# EAGLE design Schematic (EAGLE 9.6.2)
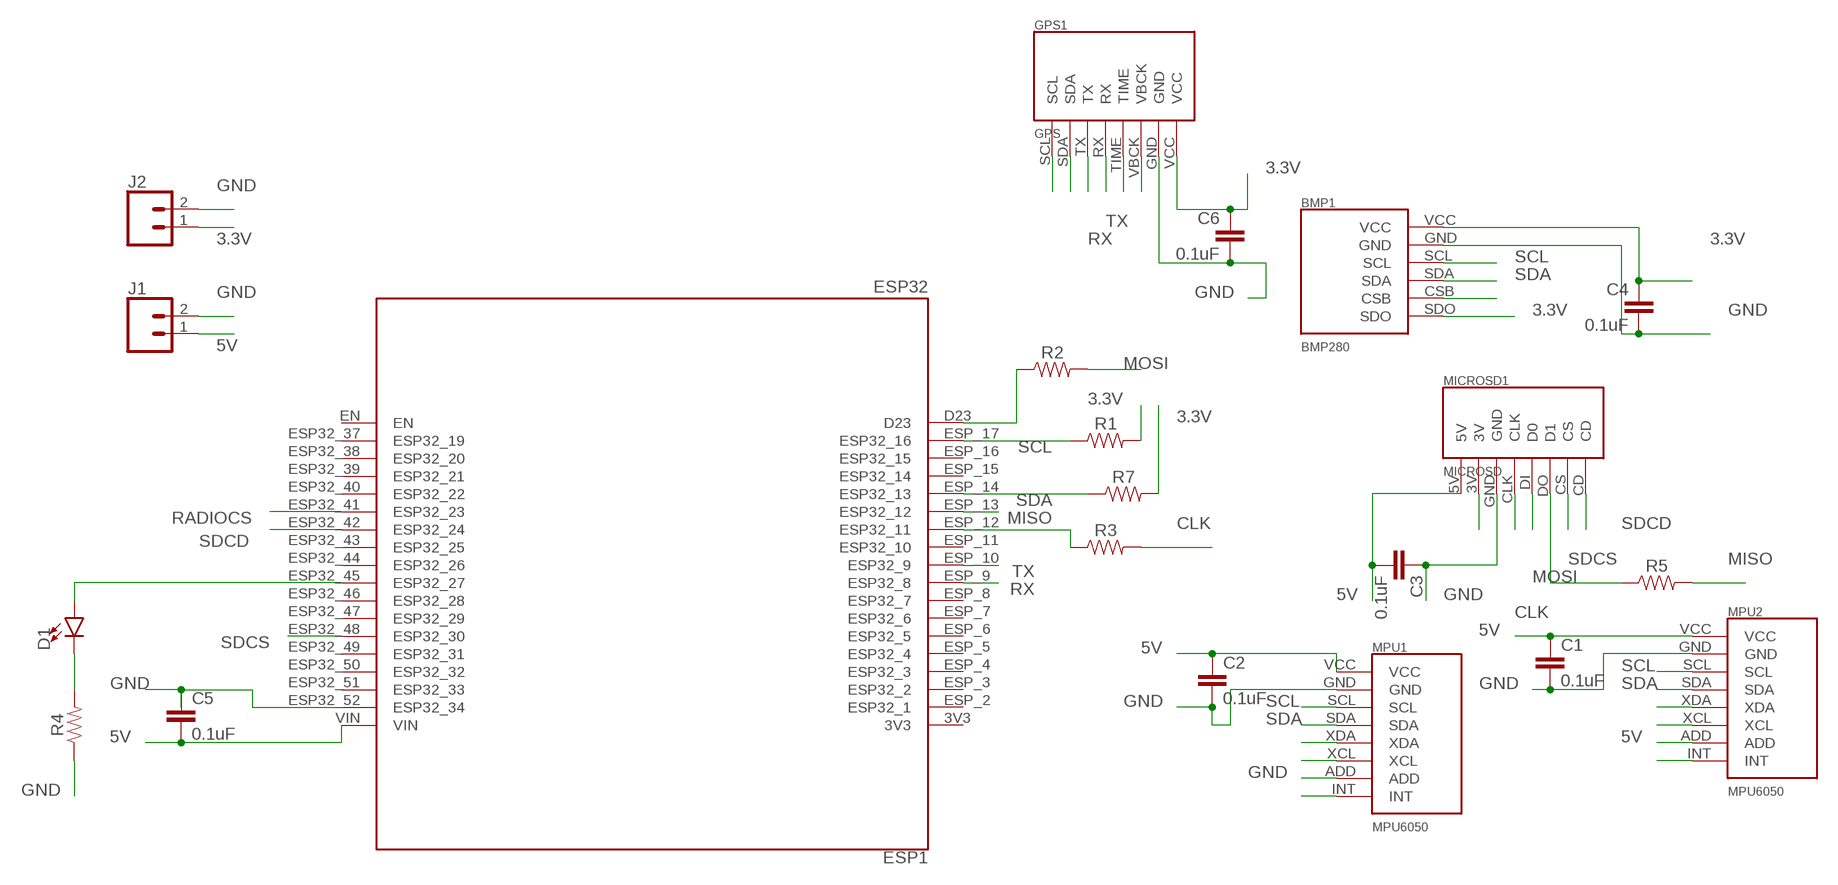
[diagram p0: schematic, sheet 1]

## Parts
BMP1  BMP280  [BMP280]
C1  0.1uF  0.1UF-KIT-EZ-50V-20%  [CAP-PTH-SMALL-KIT]
C2  0.1uF  0.1UF-KIT-EZ-50V-20%  [CAP-PTH-SMALL-KIT]
C3  0.1uF  0.1UF-KIT-EZ-50V-20%  [CAP-PTH-SMALL-KIT]
C4  0.1uF  0.1UF-KIT-EZ-50V-20%  [CAP-PTH-SMALL-KIT]
C5  0.1uF  0.1UF-KIT-EZ-50V-20%  [CAP-PTH-SMALL-KIT]
C6  0.1uF  0.1UF-KIT-EZ-50V-20%  [CAP-PTH-SMALL-KIT]
D1  LED-3MM-NO_SILK  [LED_3MM-NS]
ESP1  ESP32  [ESP32]
GPS1  GPS  [GPS]
J1  CONN_02  [1X02]
J2  CONN_02  [1X02]
MICROSD1  MICROSD  [MICROSD]
MPU1  MPU6050  [MPU6050]
MPU2  MPU6050  [MPU6050]
R1  RESISTORAXIAL-0.3  [AXIAL-0.3]
R2  RESISTORAXIAL-0.3  [AXIAL-0.3]
R3  RESISTORAXIAL-0.3  [AXIAL-0.3]
R4  RESISTORAXIAL-0.3  [AXIAL-0.3]
R5  RESISTORAXIAL-0.3  [AXIAL-0.3]
R7  RESISTORAXIAL-0.3  [AXIAL-0.3]

## Nets
3.3V: BMP1.SDO BMP1.VCC C4.1 C6.1 GPS1.VCC J2.1 R1.P$2 R7.P$2
5V: C1.1 C2.1 C3.2 C5.2 ESP1.VIN J1.1 MICROSD1.5V MPU1.VCC MPU2.ADD MPU2.VCC
CLK: MICROSD1.CLK R3.P$2
GND [GND]: BMP1.GND C1.2 C2.2 C3.1 C4.2 C5.1 C6.2 ESP1.ESP32_52(ESP32_34) GPS1.GND J1.2 J2.2 MICROSD1.GND MPU1.ADD MPU1.GND MPU2.GND R4.P$1
MISO: ESP1.ESP_13(ESP32_12) R5.P$2
MOSI: MICROSD1.DI(D0) R2.P$2
N$1: ESP1.ESP_12(ESP32_11) R3.P$1
N$2: D1.A ESP1.ESP32_45(ESP32_27)
N$3: D1.K(C) R4.P$2
N$4: MICROSD1.DO(D1) R5.P$1
N$5: ESP1.D23 R2.P$1
N$7: BMP1.CSB
N$12: GPS1.VBCK
N$13: GPS1.TIME
N$16: GPS1.SDA
N$17: GPS1.SCL
N$24: MICROSD1.3V
N$27: MPU1.XDA
N$28: MPU1.XCL
N$30: MPU1.INT
N$35: MPU2.XDA
N$36: MPU2.XCL
N$37: MPU2.INT
RADIOCS: ESP1.ESP32_41(ESP32_23)
RX: ESP1.ESP_9(ESP32_8) GPS1.TX
SCL: BMP1.SCL ESP1.ESP_17(ESP32_16) MPU1.SCL MPU2.SCL R1.P$1
SDA: BMP1.SDA ESP1.ESP_14(ESP32_13) MPU1.SDA MPU2.SDA R7.P$1
SDCD: ESP1.ESP32_42(ESP32_24) MICROSD1.CD
SDCS: ESP1.ESP32_48(ESP32_30) MICROSD1.CS
TX: ESP1.ESP_10(ESP32_9) GPS1.RX
Unconnected: ESP1.3V3 ESP1.EN ESP1.ESP32_37(ESP32_19) ESP1.ESP32_38(ESP32_20) ESP1.ESP32_39(ESP32_21) ESP1.ESP32_40(ESP32_22) ESP1.ESP32_43(ESP32_25) ESP1.ESP32_44(ESP32_26) ESP1.ESP32_46(ESP32_28) ESP1.ESP32_47(ESP32_29) ESP1.ESP32_49(ESP32_31) ESP1.ESP32_50(ESP32_32) ESP1.ESP32_51(ESP32_33) ESP1.ESP_2(ESP32_1) ESP1.ESP_3(ESP32_2) ESP1.ESP_4(ESP32_3) ESP1.ESP_5(ESP32_4) ESP1.ESP_6(ESP32_5) ESP1.ESP_7(ESP32_6) ESP1.ESP_8(ESP32_7) ESP1.ESP_11(ESP32_10) ESP1.ESP_15(ESP32_14) ESP1.ESP_16(ESP32_15)

## Library data of the parts
BMP1 = awesome:BMP280
C1-C6 = SparkFun-Capacitors:0.1UF: 0.1µF ceramic capacitors A capacitor is a passive two-terminal electrical component used to store electrical energy temporarily in an electric field.; PROD_ID: CAP-08370
D1 = SparkFun-LED:LED: LED (Generic) Standard schematic elements and footprints for 5mm, 3mm, 1206, and 0603 sized LEDs. Generic LEDs with no color specified.
ESP1 = awesome:ESP32
GPS1 = awesome:GPS
J1 J2 = SparkFun-Connectors:CONN_02: Multi connection point. Often used as Generic Header-pin footprint for 0.1 inch spaced/style header connections On any of the 0.1 inch spaced packages, you can populate with these: Break Away Headers - Straight <https://www.sparkfun.com/products/116> (PRT-00116) Break Away Male Headers - Right Angle <https://www.sparkfun.com/products/553> (PRT-00553) Female Headers <https://www.sparkfun.com/products/115> (PRT-00115) Break Away Headers - Machine Pin <https://www.sparkfun.com/products/117> (PRT-00117) Break Away Female Headers - Swiss Machine Pin <https://www.sparkfun.com/products/743> (PRT-00743) For SCREWTERMINALS and SPRING TERMINALS visit here: Screw Terimnals on SparkFun.com <https://www.sparkfun.com/search/results?term=Screw+Terminals> (5mm/3.5mm/2.54mm spacing) This device is also useful as a general connection point to wire up your design to another part of your project. Our various solder wires solder well into these plated through hole pads. Hook-Up Wire - Assortment (Stranded, 22 AWG) <https://www.sparkfun.com/products/11375> (PRT-11375) Hook-Up Wire - Assortment (Solid Core, 22 AWG) <https://www.sparkfun.com/products/11367> (PRT-11367) View the entire wire category on our website here <https://www.sparkfun.com/categories/141> Special notes: Molex polarized connector foot print use with: PRT-08233 with associated crimp pins and housings. 2.54_SCREWTERM for use with PRT-10571. 3.5mm Screw Terminal footprints for PRT-08084 5mm Screw Terminal footprints for use with PRT-08432
MICROSD1 = awesome:MICROSD
MPU1 MPU2 = awesome:MPU6050
R1-R5 R7 = SparkFun-Resistors:RESISTOR: Generic Resistor Package

## Net classes
0 default: width 0.965 mm, clearance 0.381 mm
1 GND: width 1.118 mm, clearance 0.381 mm

## Board
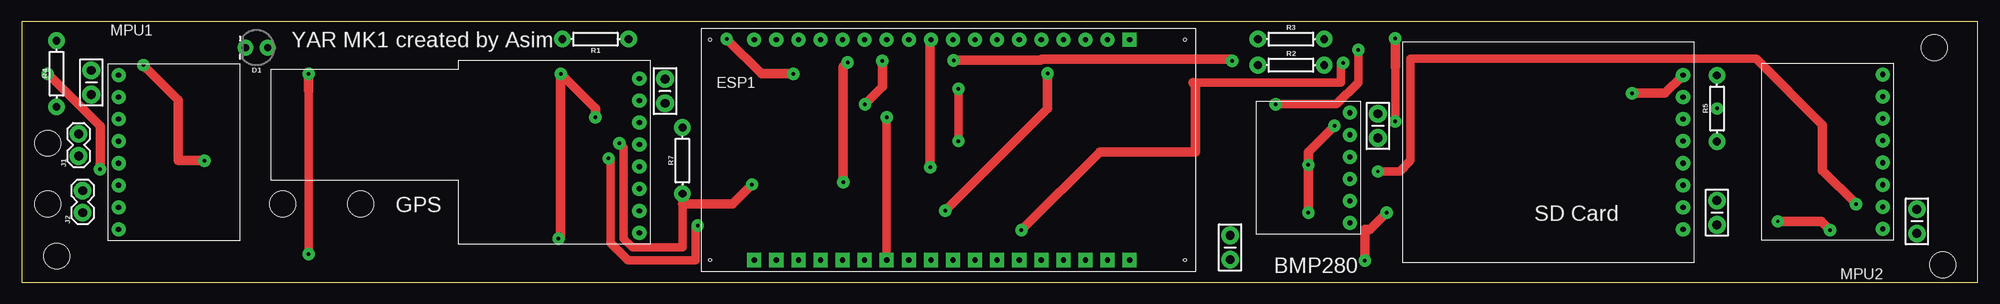
[diagram p1: board, top side]
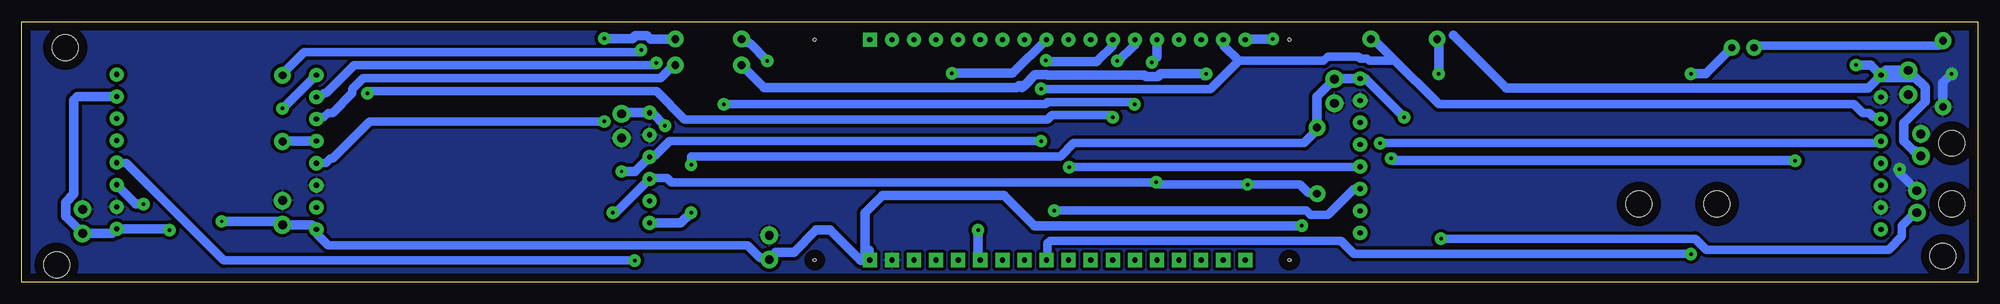
[diagram p2: board, bottom side, seen from below]

Size 225 x 30 mm. Coordinates in mm from the lower left corner, seen from the top.
Outline: 0,0 225,0 225,30 0,30 0,0
Copper layers (1*16): Top 0.035mm / dielectric 1.5mm / Bottom 0.035mm
Design rules "default *": minimum track width 6mil, minimum drill 0.4mm, track to track 14mil, track to pad 14mil, pad to pad 6mil, via to via 6mil, smd to smd 6mil, copper to edge 40mil, drill to drill 6mil, minimum pad ring 20mil, minimum via ring 20mil, stop-mask expansion 4mil, vias tented up to drill 0mil, thermal gap 10mil
Holes 3 mm at 220,27 221,2 30,9 39,9 4,3 3,9 3,16

### Footprints (pad centres in the part's own frame; a part is rotated, then mirrored left to right if it is on the bottom)
BMP280 = drill 0.6: CSB 10.795,3.81; GND 10.795,11.43; SCL 10.795,8.89; SDA 10.795,6.35; SDO 10.795,1.27; VCC 10.795,13.97
CAP-PTH-SMALL-KIT = drill 1.016 pad 2.032: 1 -1.397,0; 2 1.397,0
LED_3MM-NS = drill 0.813: A -1.27,0; K 1.27,0
ESP32 = drill 0.6 square: 3V3 1.27,-7.62; EN 26.67,-50.8; ESP32_37 26.67,-48.26; ESP32_38 26.67,-45.72; ESP32_39 26.67,-43.18; ESP32_40 26.67,-40.64; ESP32_41 26.67,-38.1; ESP32_42 26.67,-35.56; ESP32_43 26.67,-33.02; ESP32_44 26.67,-30.48; ESP32_45 26.67,-27.94; ESP32_46 26.67,-25.4; ESP32_47 26.67,-22.86; ESP32_48 26.67,-20.32; ESP32_49 26.67,-17.78; ESP32_50 26.67,-15.24; ESP32_51 26.67,-12.7; ESP32_52 26.67,-10.16; VIN 26.67,-7.62 | drill 0.6: D23 1.27,-50.8; ESP_2 1.27,-10.16; ESP_3 1.27,-12.7; ESP_4 1.27,-15.24; ESP_5 1.27,-17.78; ESP_6 1.27,-20.32; ESP_7 1.27,-22.86; ESP_8 1.27,-25.4; ESP_9 1.27,-27.94; ESP_10 1.27,-30.48; ESP_11 1.27,-33.02; ESP_12 1.27,-35.56; ESP_13 1.27,-38.1; ESP_14 1.27,-40.64; ESP_15 1.27,-43.18; ESP_16 1.27,-45.72; ESP_17 1.27,-48.26 | hole 0.35: 1.27,-1.27; 26.67,-1.27; 1.27,-55.88; 26.67,-55.88
GPS = drill 0.6: GND 16.51,1.27; RX 8.89,1.27; SCL 1.27,1.27; SDA 3.81,1.27; TIME 11.43,1.27; TX 6.35,1.27; VBCK 13.97,1.27; VCC 19.05,1.27
1X02 = drill 1.016 pad 1.88: 1 0,0; 2 2.54,0
MICROSD = drill 0.6: 3V 6.35,1.27; 5V 3.81,1.27; CD 21.59,1.27; CLK 11.43,1.27; CS 19.05,1.27; DI 16.51,1.27; DO 13.97,1.27; GND 8.89,1.27
MPU6050 = drill 0.6: ADD 1.27,3.81; GND 1.27,16.51; INT 1.27,1.27; SCL 1.27,13.97; SDA 1.27,11.43; VCC 1.27,19.05; XCL 1.27,6.35; XDA 1.27,8.89
AXIAL-0.3 = drill 0.9 pad 1.88: P$1 -3.81,0; P$2 3.81,0

### Placement (x,y rotation side)
BMP1  141.99,5.54 0 top
C1  8,23 270 top
C2  139,4 90 top
C3  195,8 270 top
C4  74,22 270 top
C5  218,7 270 top
C6  156,18 270 top
D1  27,27 180 top
ESP1  135.06,29.21 270 top
GPS1  72.31,4.41 90 top
J1  6.54,14.54 90 top
J2  7,8 90 top
MICROSD1  192.37,2.27 90 top
MPU1  9.87,4.81 0 top
MPU2  215.35,25.19 180 top
R1  66,28 180 top
R2  146,25 0 top
R3  146,28 0 top
R4  4,24 90 top
R5  195,20 90 top
R7  76,14 90 top

### Tracks (layer width: path | path; a pad name or v marks a point on that pad's centre or on a via)
3.3V  (via drill 0.4)
  Top 1.118: v61.75,5 62,5.25 v62,24 66,20 v66,19 | v148,8 v148,13.5 148,15 v151,18
  Bottom 0.965: J2.1 7.25,7.75 7.5,7.75 8.75,6.5 8.75,5.25 10.25,3.75 31.25,3.75 32.5,5 v61.75,5 | v148,13.5 148,14.5 105.5,14.5 104,16 77.5,16 76,17.5 R7.P$2
  Bottom 1.118: C6.1 155.89,19.51 BMP1.VCC 152.51,19.51 v151,18 | R1.P$2 62,27.81 v62,24 | v66,19 70.46,23.46 GPS1.VCC 73.94,23.46 C4.1 76,21.4 R7.P$2 | BMP1.SDO 149.19,6.81 v148,8
5V  (via drill 0.4)
  Top 0.965: v67.5,14.25 67.75,14 67.75,4.5 69.75,2.5 77.5,2.5 77.5,6.25 v77.75,6.5
  Top 1.118: v202,7 207,7 v208,6 | v14,25 18,21 18,14 v21,14
  Bottom 0.965: C2.1 139,2.75 140,2.75 141.5,4.25 189.75,4.25 191,5.5 191,6 MICROSD1.5V | v67.5,14.25 67.25,14.5 | 127.5,3.75 127.5,2.75 ESP1.VIN
  Bottom 1.118: MICROSD1.5V 191.62,6.6 C3.2 195.4,7 v202,7 | MPU2.ADD 218.62,21.38 219,21 219,10.16 219.96,9.21 219.96,7.56 C5.2 214.62,5.6 MPU2.VCC 208.14,6.14 v208,6 | J1.1 7.12,15.12 7.35,15.12 8.5,16.27 8.5,18.34 6.04,20.79 6.04,22.44 7.3,23.7 | 7.3,23.7 C1.1 10.6,24.4 MPU1.VCC 12.28,25 v14,25 | v77.75,6.5 108.5,6.5 112,10 126,10 128,8 128,3.25 127.5,2.75 | ESP1.VIN 128.54,2.54 132,6 133.63,6 136.19,3.44 138.31,3.44 139,2.75 | 7.3,23.7 7.44,23.56 11.37,23.56 12.58,22.35 54.22,22.35 60.29,28.43 | v21,14 67.25,14 v67.5,14.25
CLK  (via drill 0.4)
  Top 0.965: 158,24.75 v158,18.5
  Top 1.118: v158,28.07 158,24.75
  Bottom 0.965: v158,18.5 185,18.5 189.25,14.25 189.5,14.25 190,13.75 191,13.75 MICROSD1.CLK
  Bottom 1.118: R3.P$2 152.67,28 153.07,28.4 154.43,28.4 154.76,28.07 v158,28.07
GND  (via drill 0.4)
  Top 1.118: v3,24 9,18 v9,13
  Bottom 1.118: R4.P$1 4,23 v3,24 | v9,13 9,12.54 J2.2
  pour Bottom: 0,0 0,30 225,30 225,0
MISO  (via drill 0.4)
  Top 0.965: v144.25,20.5 151.25,20.5 153.75,23 v153.75,26.75
  Top 1.118: v97,20.5 99,22.5 v99,25.47
  Bottom 0.965: v97,20.5 97.25,20.75 107,20.75 107.25,20.5 v144.25,20.5 | v153.75,26.75 154,26.5 192.5,26.5 194.75,24.25 194.75,24 195,24 R5.P$2
  Bottom 1.118: v99,25.47 99,25.32 96.96,27.36 ESP1.ESP_13
MOSI
  Bottom 0.965: R2.P$2 150.25,25 150.25,24.75 151.5,23.5 185.75,23.5 187,22.25 187,21.75 189.25,19.5 189.75,19.5 190.25,19 191,19 MICROSD1.DI
N$1  (via drill 0.4)
  Top 1.118: v107.18,25.55 117.16,25.55 117.32,25.7 139.05,25.7 v139.25,25.5
  Bottom 0.965: ESP1.ESP_12 99.5,27.25 101.25,25.5 | v139.25,25.5 141.25,27.5 141.5,27.5 141.75,27.75 141.75,28 R3.P$1
  Bottom 1.118: 101.25,25.5 101.35,25.4 107.03,25.4 v107.18,25.55
N$2  (via drill 0.4)
  Top 0.965: 33,22.5 33,22 v33,3.25
  Top 1.118: 33,22 v33,24
  Bottom 0.965: v33,3.25 71.75,3.25 73.25,4.75 106.75,4.75 107,4.5 107,2.75 ESP1.ESP32_45
  Bottom 1.118: v33,24 31.27,24 D1.A
N$3
  Bottom 0.965: D1.K 25.5,27 25.25,27.25 4.5,27.25 4,27.75 R4.P$2
N$4
  Bottom 1.118: MICROSD1.DO 194.95,16.24 R5.P$1
N$5  (via drill 0.4)
  Top 0.965: v88.75,24 88.25,24
  Top 1.118: v88.75,24 85.08,24 v81.08,28
  Bottom 0.965: 89,23.75 v88.75,24
  Bottom 1.118: v88.75,24 93.99,24 94.32,23.67 95.68,23.67 95.83,23.82 106.99,23.82 107.07,23.9 108.43,23.9 109.67,22.66 | v81.08,28 84.2,28 ESP1.D23 | 109.92,22.41 109.67,22.66 | 109.67,22.66 110.28,22.66 110.54,22.41 139.59,22.41 R2.P$1
RX  (via drill 0.4)
  Top 1.118: v106.25,8.25 118,20 v118,24.05
  Bottom 0.965: v106.25,8.25 77.25,8.25 76.75,7.75 74.75,7.75 71.75,10.75 71.25,10.75 GPS1.TX
  Bottom 1.118: v118,24.05 111.01,24.05 ESP1.ESP_9
SCL  (via drill 0.4)
  Top 0.965: v107.75,22.25 v107.75,16.25 | 207.12,18.12 199.5,25.75 159.75,25.75 159.75,14 158.5,12.75 v156,12.75
  Top 1.118: v211,9 207.12,12.88 207.12,18.12
  Bottom 0.965: 67.25,25.75 69.5,28 R1.P$1 | 67.25,25.75 62,20.5 14.25,20.5 13.25,19.5 12.5,19.5 12,19 11.25,19 MPU1.SCL | 85,25.5 86.75,27.25 86.75,27.75 ESP1.ESP_17 | 85,25.5 75.25,25.5 74.75,26 71.25,26 71,25.75 70.25,25.75 70,25.5 67.5,25.5 67.25,25.75 | v107.75,16.25 150.5,16.25 152.25,14.5 152.75,14.5 BMP1.SCL | v107.75,22.25 88.25,22.25 85,25.5
  Bottom 1.118: MPU2.SCL 211.86,9 v211,9 | BMP1.SCL 154.47,12.75 v156,12.75
SDA  (via drill 0.4)
  Top 0.965: v68.75,16 69.25,15.5 69.25,5 70.25,4 76,4 76,9 R7.P$1
  Top 1.118: v94.5,11.5 94.5,24.82 v95,25.32 | v84,11.25 81.75,9 76,9 | 154.53,6.09 154.5,6.05 | 154.5,6.05 v154.5,2.5 | v157,8 155.05,6.05 154.5,6.05
  Bottom 0.965: v68.75,16 11.25,16 MPU1.SDA | BMP1.SDA 152.75,12 150.75,12 150.25,11.5 v94.5,11.5 94.25,11.25 v84,11.25 78,11.25 77,10.25 76,10.25 R7.P$1 | v154.5,2.5 201.75,2.5 213,13.75 214,13.75 MPU2.SDA
  Bottom 1.118: v95,25.32 94.42,25.9 ESP1.ESP_14 | BMP1.SDA 156.68,8 v157,8
SDCD  (via drill 0.4)
  Top 0.965: v99.5,19 ESP1.ESP32_42 | 191,23.75 MICROSD1.CD
  Top 1.118: v185.25,21.75 189,21.75 191,23.75
  Bottom 0.965: v99.5,19 99.75,19.25 106.5,19.25 107,18.75 148.75,18.75 152,22 185,22 v185.25,21.75
  Bottom 1.118: v195,20 191.14,23.86 MICROSD1.CD
SDCS  (via drill 0.4)
  Top 0.965: 134.75,23 151.75,23 151.75,25 v152,25.25
  Top 1.118: v115,6 124,15 135,15 135,22.75 134.75,23
  Bottom 0.965: v152,25.25 152.25,25 186.75,25 190,21.75 190.25,21.75 190.75,21.25 191,21.25 MICROSD1.CS
  Bottom 1.118: ESP1.ESP32_48 115,2.8 v115,6
TX  (via drill 0.4)
  Top 1.118: ESP1.ESP_10 104.5,27.86 v104.5,13.25
  Bottom 0.965: v104.5,13.25 71.25,13.25 GPS1.RX

### Text on the board
tNames: YAR MK1 | created by Asim | GPS | SD Card | BMP280